# EasyEDA schematic gld_schematic_v2.json

## Sheets
1 Sheet_1
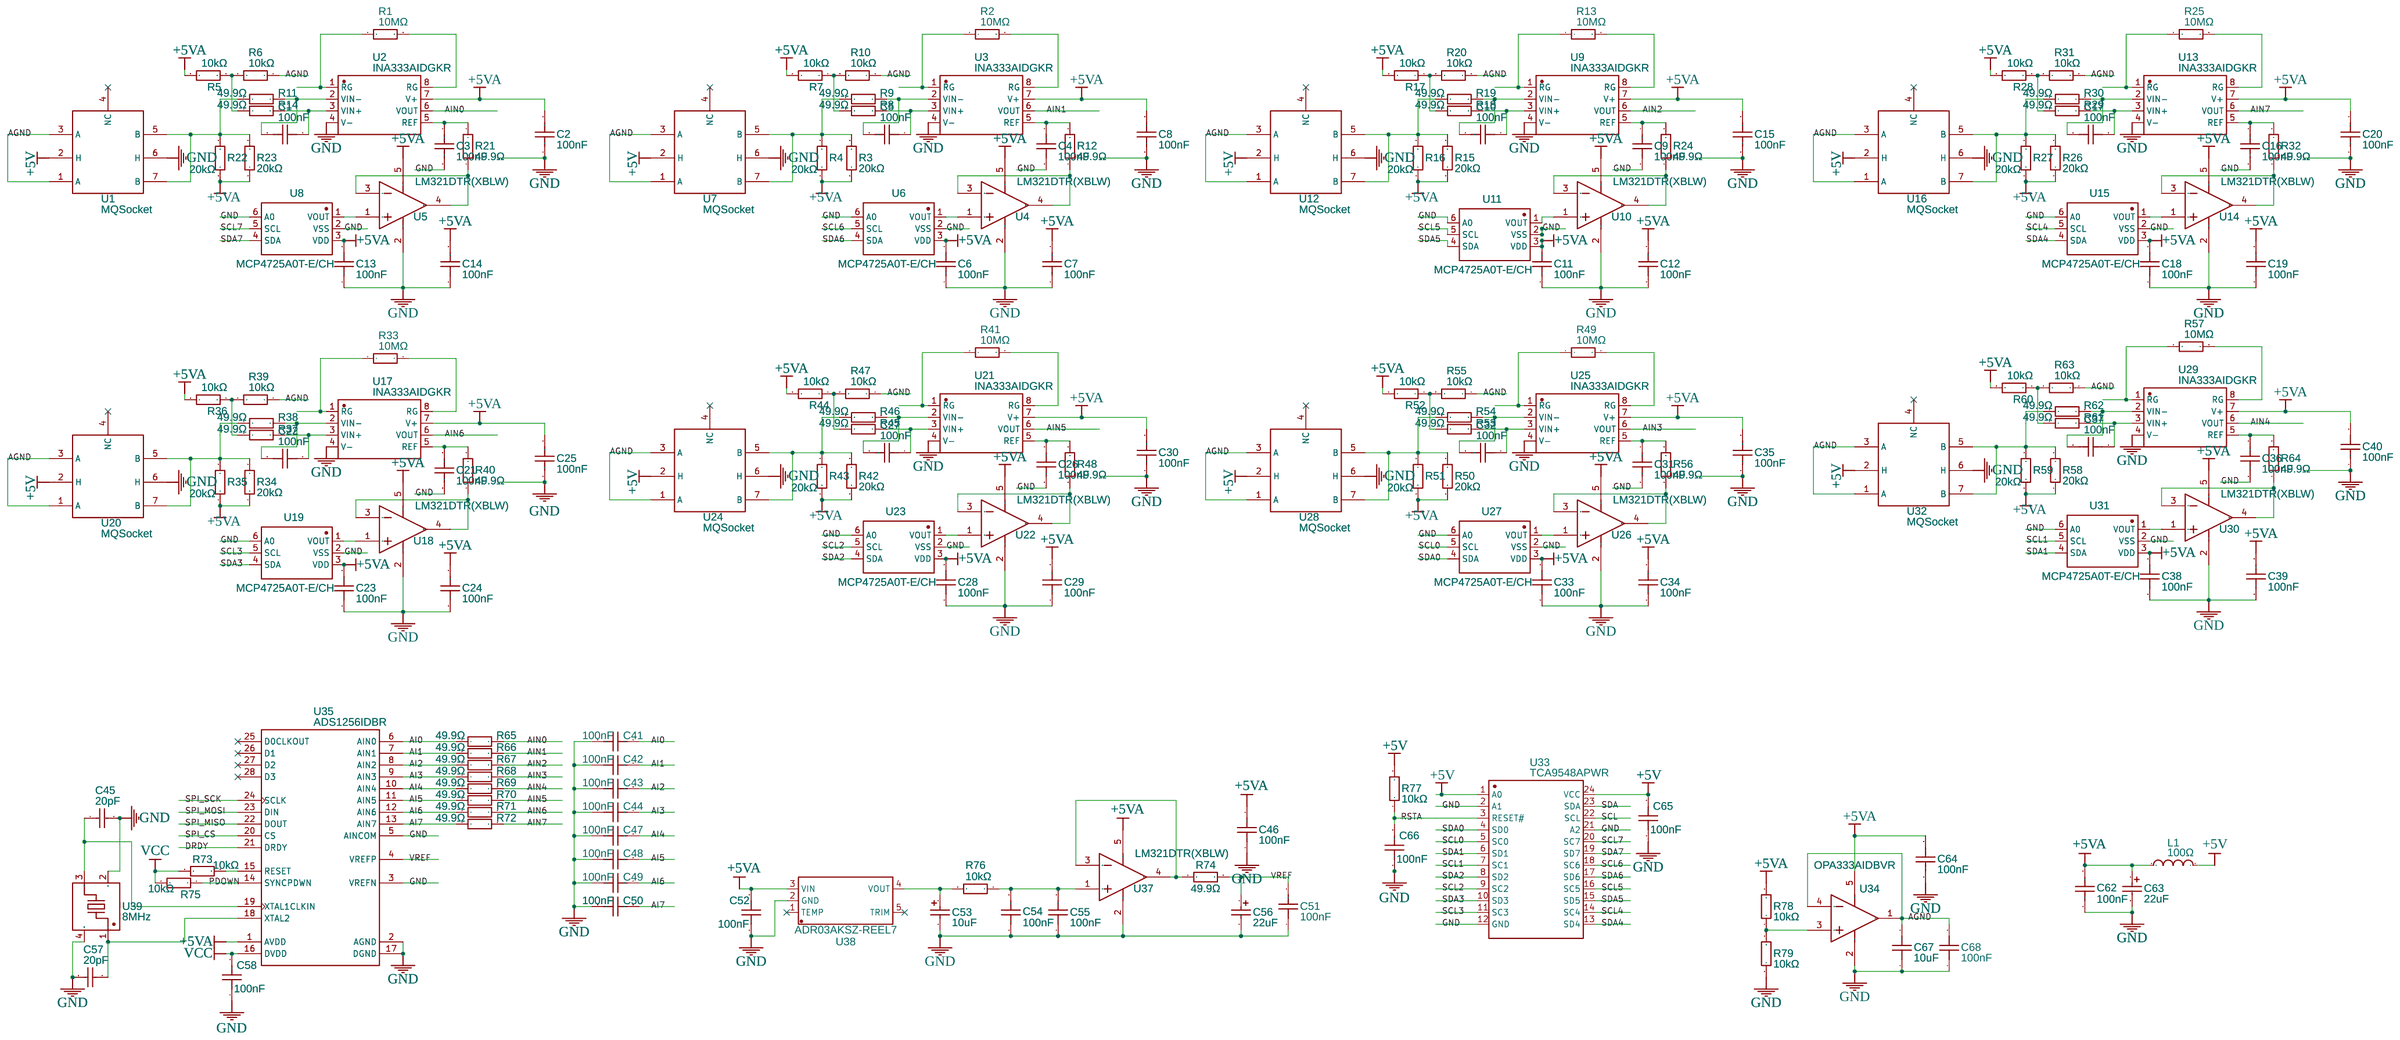
[diagram p0: Sheet_1]
2 Sheet_2: TITLE: Sheet_2; REV: 1.0; Date: 2026-03-14; Sheet: 1/1; Drawn By: mamanbudiman; Company: Your Company
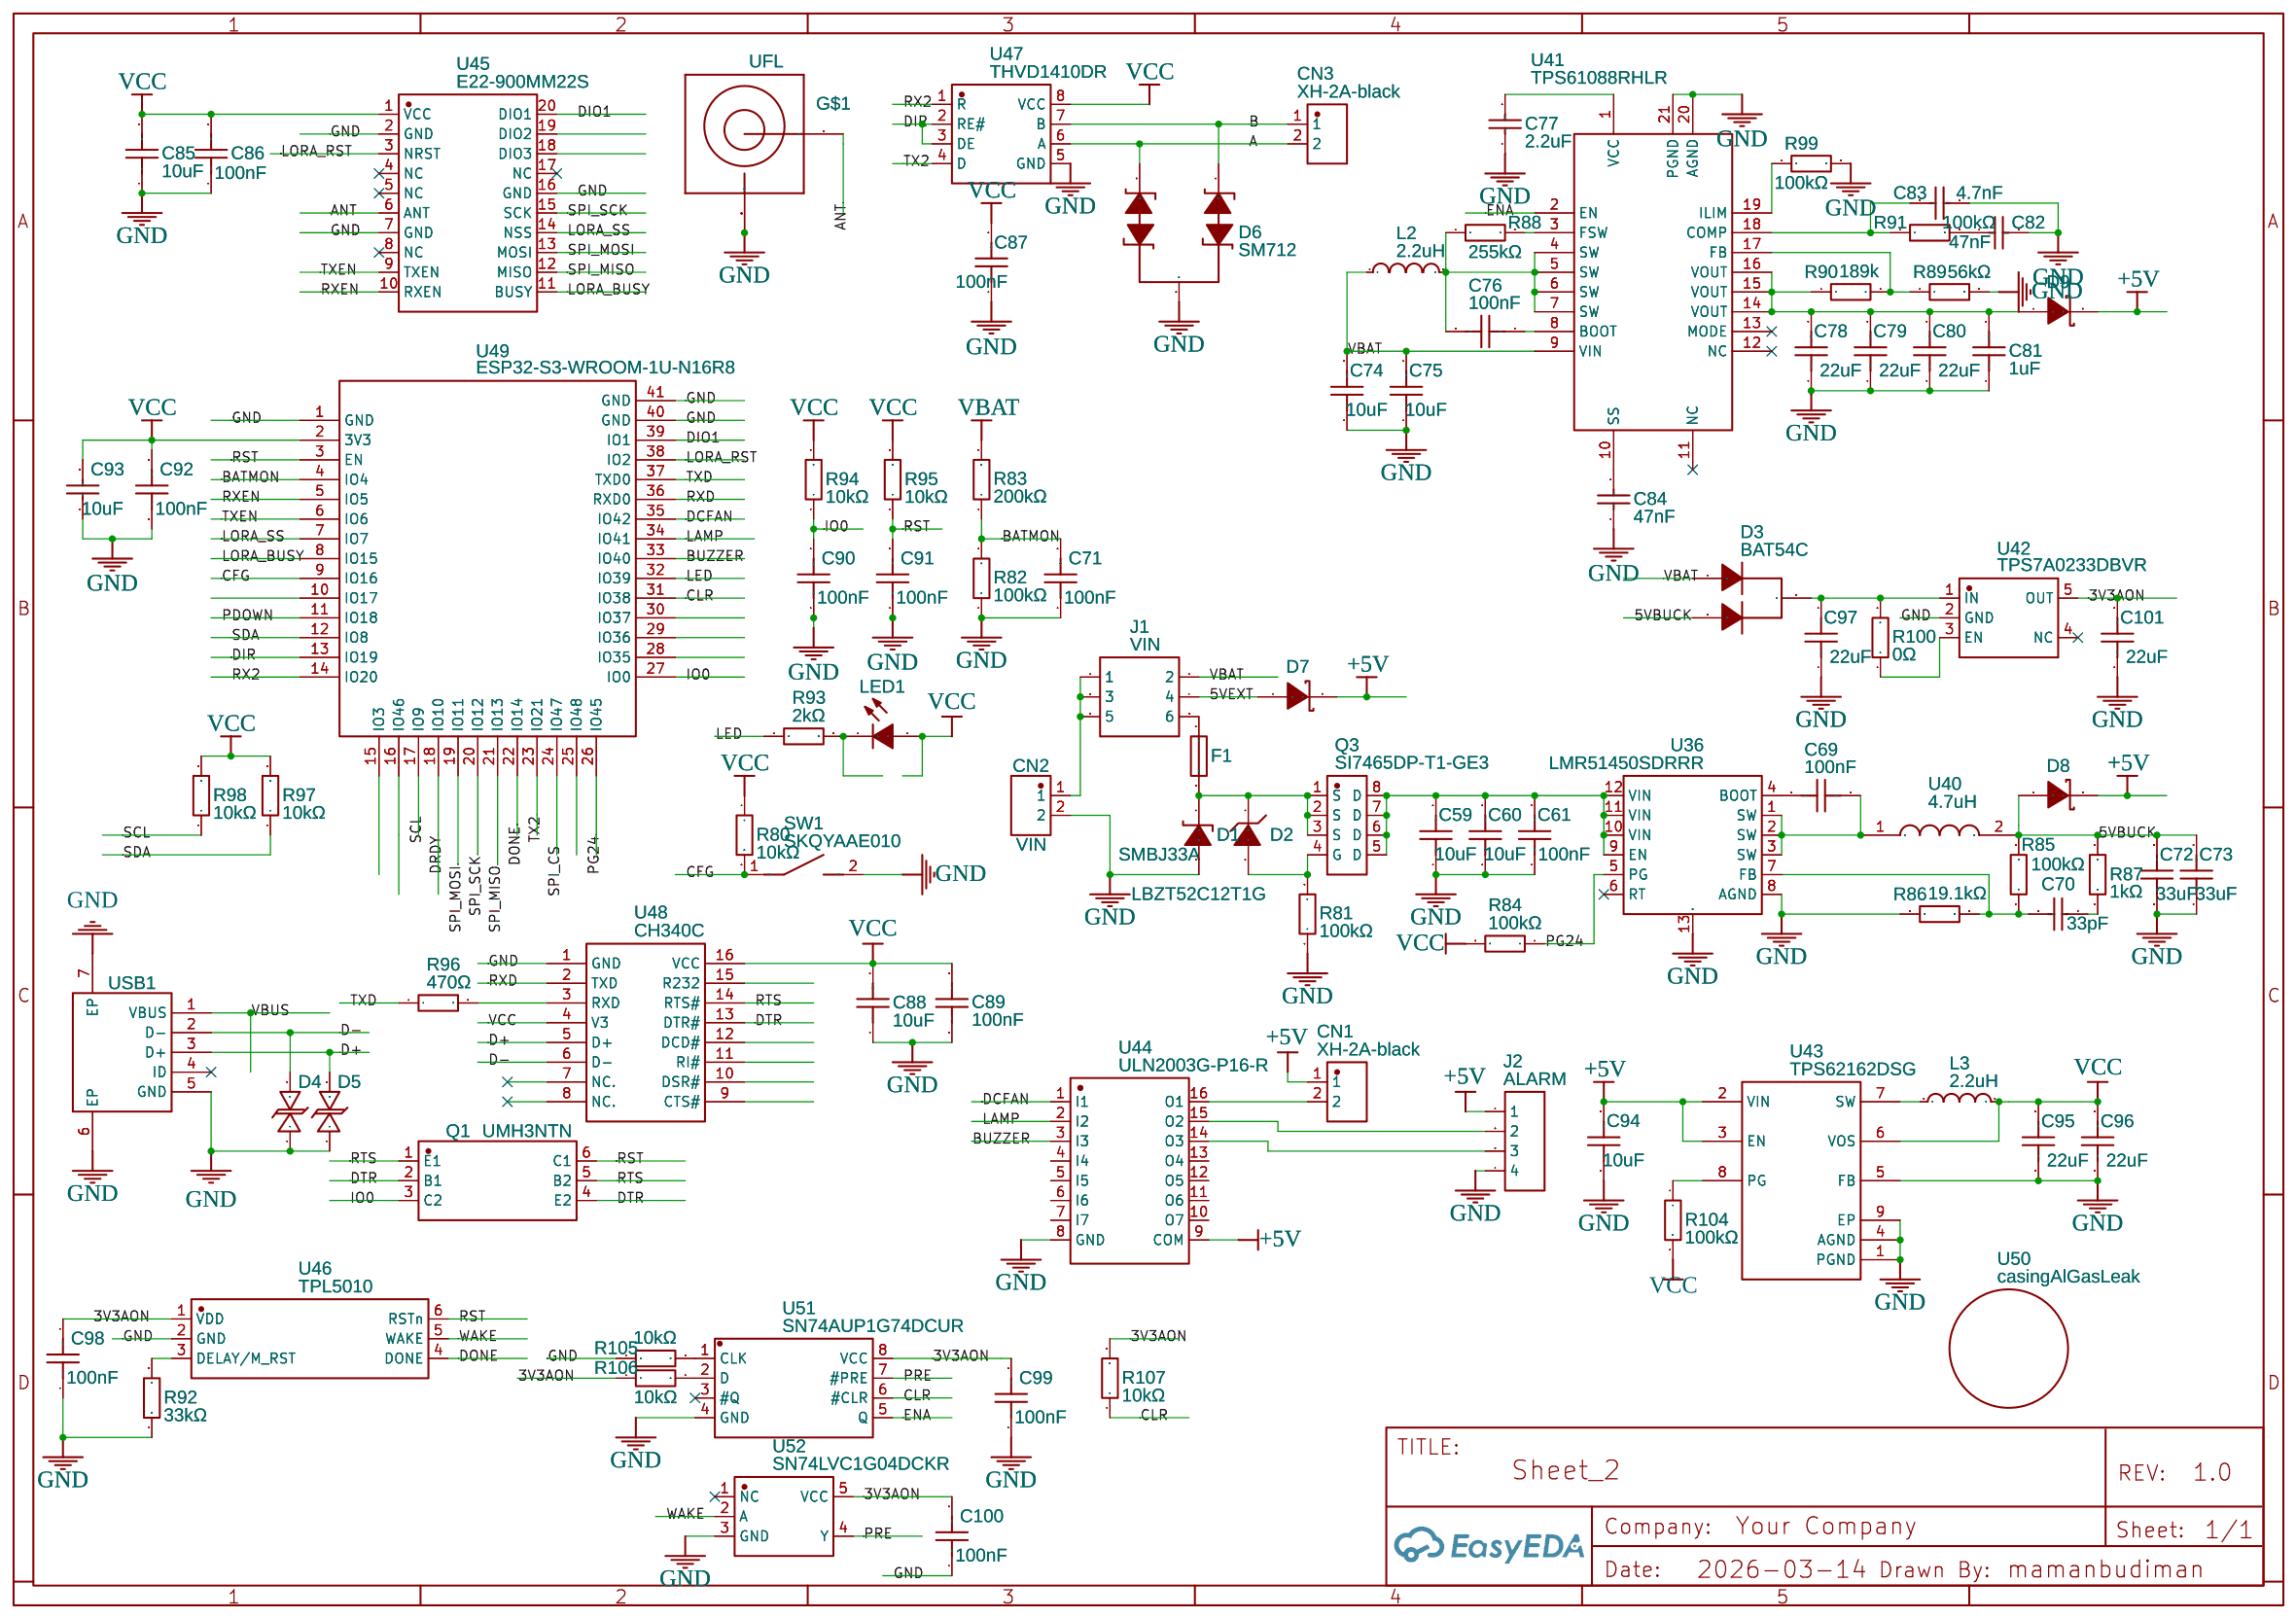
[diagram p1: Sheet_2]

## Parts
sheet Sheet_1
C1  100nF  [C0402]
C2  100nF  [C0402]
C3  100nF  [C0402]
C4  100nF  [C0402]
C5  100nF  [C0402]
C6  100nF  [C0402]
C7  100nF  [C0402]
C8  100nF  [C0402]
C9  100nF  [C0402]
C10  100nF  [C0402]
C11  100nF  [C0402]
C12  100nF  [C0402]
C13  100nF  [C0402]
C14  100nF  [C0402]
C15  100nF  [C0402]
C16  100nF  [C0402]
C17  100nF  [C0402]
C18  100nF  [C0402]
C19  100nF  [C0402]
C20  100nF  [C0402]
C21  100nF  [C0402]
C22  100nF  [C0402]
C23  100nF  [C0402]
C24  100nF  [C0402]
C25  100nF  [C0402]
C26  100nF  [C0402]
C27  100nF  [C0402]
C28  100nF  [C0402]
C29  100nF  [C0402]
C30  100nF  [C0402]
C31  100nF  [C0402]
C32  100nF  [C0402]
C33  100nF  [C0402]
C34  100nF  [C0402]
C35  100nF  [C0402]
C36  100nF  [C0402]
C37  100nF  [C0402]
C38  100nF  [C0402]
C39  100nF  [C0402]
C40  100nF  [C0402]
C41  100nF  [C0402]
C42  100nF  [C0402]
C43  100nF  [C0402]
C44  100nF  [C0402]
C45  20pF  [C0402]
C46  100nF  [C0402]
C47  100nF  [C0402]
C48  100nF  [C0402]
C49  100nF  [C0402]
C50  100nF  [C0402]
C51  100nF  [C0402]
C52  100nF  [C0402]
C53  10uF  [CAP-SMD_L3.2-W1.6-RD-C7171]
C54  100nF  [C0402]
C55  100nF  [C0402]
C56  22uF  [CASE-A_3216]
C57  20pF  [C0402]
C58  100nF  [C0603]
C62  100nF  [C0402]
C63  22uF  [CASE-A_3216]
C64  100nF  [C0603]
C65  100nF  [C0603]
C66  100nF  [C0603]
C67  10uF  [C0603]
C68  100nF  [C0603]
L1  100Ω  [L0805]
R1  10MΩ  [R0603]
R2  10MΩ  [R0603]
R3  20kΩ  [R0603]
R4  20kΩ  [R0603]
R5  10kΩ  [R0603]
R6  10kΩ  [R0603]
R7  10kΩ  [R0603]
R8  49.9Ω  [R0402]
R9  49.9Ω  [R0402]
R10  10kΩ  [R0603]
R11  49.9Ω  [R0402]
R12  49.9Ω  [R0402]
R13  10MΩ  [R0603]
R14  49.9Ω  [R0402]
R15  20kΩ  [R0603]
R16  20kΩ  [R0603]
R17  10kΩ  [R0603]
R18  49.9Ω  [R0402]
R19  49.9Ω  [R0402]
R20  10kΩ  [R0603]
R21  49.9Ω  [R0402]
R22  20kΩ  [R0603]
R23  20kΩ  [R0603]
R24  49.9Ω  [R0402]
R25  10MΩ  [R0603]
R26  20kΩ  [R0603]
R27  20kΩ  [R0603]
R28  10kΩ  [R0603]
R29  49.9Ω  [R0402]
R30  49.9Ω  [R0402]
R31  10kΩ  [R0603]
R32  49.9Ω  [R0402]
R33  10MΩ  [R0603]
R34  20kΩ  [R0603]
R35  20kΩ  [R0603]
R36  10kΩ  [R0603]
R37  49.9Ω  [R0402]
R38  49.9Ω  [R0402]
R39  10kΩ  [R0603]
R40  49.9Ω  [R0402]
R41  10MΩ  [R0603]
R42  20kΩ  [R0603]
R43  20kΩ  [R0603]
R44  10kΩ  [R0603]
R45  49.9Ω  [R0402]
R46  49.9Ω  [R0402]
R47  10kΩ  [R0603]
R48  49.9Ω  [R0402]
R49  10MΩ  [R0603]
R50  20kΩ  [R0603]
R51  20kΩ  [R0603]
R52  10kΩ  [R0603]
R53  49.9Ω  [R0402]
R54  49.9Ω  [R0402]
R55  10kΩ  [R0603]
R56  49.9Ω  [R0402]
R57  10MΩ  [R0603]
R58  20kΩ  [R0603]
R59  20kΩ  [R0603]
R60  10kΩ  [R0603]
R61  49.9Ω  [R0402]
R62  49.9Ω  [R0402]
R63  10kΩ  [R0603]
R64  49.9Ω  [R0402]
R65  49.9Ω  [R0402]
R66  49.9Ω  [R0402]
R67  49.9Ω  [R0402]
R68  49.9Ω  [R0402]
R69  49.9Ω  [R0402]
R70  49.9Ω  [R0402]
R71  49.9Ω  [R0402]
R72  49.9Ω  [R0402]
R73  10kΩ  [R0603]
R74  49.9Ω  [R0402]
R75  10kΩ  [R0603]
R76  10kΩ  [R0603]
R77  10kΩ  [R0603]
R78  10kΩ  [R0603]
R79  10kΩ  [R0603]
U1  MQSocket  [MQ_SOCKET]
U2  INA333AIDGKR  [MSOP-8_L3.0-W3.0-P0.65-LS5.0-BL]
U3  INA333AIDGKR  [MSOP-8_L3.0-W3.0-P0.65-LS5.0-BL]
U4  LM321DTR(XBLW)  [SOT-23-5_L2.9-W1.6-P0.95-LS2.8-BR]
U5  LM321DTR(XBLW)  [SOT-23-5_L2.9-W1.6-P0.95-LS2.8-BR]
U6  MCP4725A0T-E/CH  [SOT-23-6_L2.9-W1.6-P0.95-LS2.8-BL]
U7  MQSocket  [MQ_SOCKET]
U8  MCP4725A0T-E/CH  [SOT-23-6_L2.9-W1.6-P0.95-LS2.8-BL]
U9  INA333AIDGKR  [MSOP-8_L3.0-W3.0-P0.65-LS5.0-BL]
U10  LM321DTR(XBLW)  [SOT-23-5_L2.9-W1.6-P0.95-LS2.8-BR]
U11  MCP4725A0T-E/CH  [SOT-23-6_L2.9-W1.6-P0.95-LS2.8-BL]
U12  MQSocket  [MQ_SOCKET]
U13  INA333AIDGKR  [MSOP-8_L3.0-W3.0-P0.65-LS5.0-BL]
U14  LM321DTR(XBLW)  [SOT-23-5_L2.9-W1.6-P0.95-LS2.8-BR]
U15  MCP4725A0T-E/CH  [SOT-23-6_L2.9-W1.6-P0.95-LS2.8-BL]
U16  MQSocket  [MQ_SOCKET]
U17  INA333AIDGKR  [MSOP-8_L3.0-W3.0-P0.65-LS5.0-BL]
U18  LM321DTR(XBLW)  [SOT-23-5_L2.9-W1.6-P0.95-LS2.8-BR]
U19  MCP4725A0T-E/CH  [SOT-23-6_L2.9-W1.6-P0.95-LS2.8-BL]
U20  MQSocket  [MQ_SOCKET]
U21  INA333AIDGKR  [MSOP-8_L3.0-W3.0-P0.65-LS5.0-BL]
U22  LM321DTR(XBLW)  [SOT-23-5_L2.9-W1.6-P0.95-LS2.8-BR]
U23  MCP4725A0T-E/CH  [SOT-23-6_L2.9-W1.6-P0.95-LS2.8-BL]
U24  MQSocket  [MQ_SOCKET]
U25  INA333AIDGKR  [MSOP-8_L3.0-W3.0-P0.65-LS5.0-BL]
U26  LM321DTR(XBLW)  [SOT-23-5_L2.9-W1.6-P0.95-LS2.8-BR]
U27  MCP4725A0T-E/CH  [SOT-23-6_L2.9-W1.6-P0.95-LS2.8-BL]
U28  MQSocket  [MQ_SOCKET]
U29  INA333AIDGKR  [MSOP-8_L3.0-W3.0-P0.65-LS5.0-BL]
U30  LM321DTR(XBLW)  [SOT-23-5_L2.9-W1.6-P0.95-LS2.8-BR]
U31  MCP4725A0T-E/CH  [SOT-23-6_L2.9-W1.6-P0.95-LS2.8-BL]
U32  MQSocket  [MQ_SOCKET]
U33  TCA9548APWR  [TSSOP-24_L7.8-W4.4-P0.65-LS6.4-BL]
U34  OPA333AIDBVR  [SOT-23-5_L3.0-W1.7-P0.95-LS2.8-BR]
U35  ADS1256IDBR  [SSOP-28_L10.2-W5.3-P0.65-LS7.8-BL]
U37  LM321DTR(XBLW)  [SOT-23-5_L2.9-W1.6-P0.95-LS2.8-BR]
U38  ADR03AKSZ-REEL7  [SC-70-5_L2.0-W1.3-P0.65-LS2.1-BL]
U39  8MHz  [CRYSTAL-SMD_4P-L3.2-W2.5-BL-1]
sheet Sheet_2
C59  10uF  [C0805]
C60  10uF  [C0805]
C61  100nF  [C0603]
C69  100nF  [C0603]
C70  33pF  [C0603]
C71  100nF  [C0603]
C72  33uF  [C0805]
C73  33uF  [C0805]
C74  10uF  [C0805]
C75  10uF  [C0805]
C76  100nF  [C0603]
C77  2.2uF  [C0603]
C78  22uF  [C0603]
C79  22uF  [C0603]
C80  22uF  [C0603]
C81  1uF  [C0603]
C82  47nF  [C0603]
C83  4.7nF  [C0603]
C84  47nF  [C0603]
C85  10uF  [C0603]
C86  100nF  [C0603]
C87  100nF  [C0402]
C88  10uF  [C0603]
C89  100nF  [C0603]
C90  100nF  [C0603]
C91  100nF  [C0603]
C92  100nF  [C0603]
C93  10uF  [C1206]
C94  10uF  [C0805]
C95  22uF  [C0603]
C96  22uF  [C0603]
C97  22uF  [C0603]
C98  100nF  [C0603]
C99  100nF  [C0603]
C100  100nF  [C0603]
C101  22uF  [C0603]
CN1  XH-2A-black  [CONN-TH_2P-P2.50_XH-2A-BLACK]
CN2  VIN  [CONN-TH_2P-P2.50_XH-2A-BLACK]
CN3  XH-2A-black  [CONN-TH_2P-P2.50_XH-2A-BLACK]
D1  SMBJ33A  [SMB_L4.6-W3.6-LS5.3-RD]
D2  LBZT52C12T1G  [SOD-123_L2.8-W1.8-LS3.7-RD]
D3  BAT54C  [SOT-23-3_L2.9-W1.6-P1.90-LS2.8-BR]
D4  LESD5D5.0CT1G_C5199850  [SOD-523_L1.2-W0.8-LS1.6-BI]
D5  LESD5D5.0CT1G_C5199850  [SOD-523_L1.2-W0.8-LS1.6-BI]
D6  SM712  [SOT-23_L2.9-W1.3-P1.90-LS2.4-BR]
D7  SS54_C22452  [SMA_L4.4-W2.8-LS5.4-R-RD]
D8  SS54_C22452  [SMA_L4.4-W2.8-LS5.4-R-RD]
D9  SS54_C22452  [SMA_L4.4-W2.8-LS5.4-R-RD]
F1  MINISMDC260F/16  [F1812]
G$1  UFL  [U.FL-R-SMT-1(60)]
J1  VIN  [HDR-M-2.54_2X3]
J2  ALARM  [HDR-M-2.54_1X4]
L2  2.2uH  [IND-SMD_L10.4-W10.3]
L3  2.2uH  [IND-SMD_L3.0-W3.0_SMNR3015]
LED1  19-217/BHC-ZL1M2RY/3T  [LED0603-R-RD]
Q1  UMH3NTN  [SOT-363_L2.0-W1.3-P0.65-LS2.1-TL]
Q3  SI7465DP-T1-GE3  [POWERPAK-SO-8_L5.9-W4.9-P1.27-LS6.2-BL]
R80  10kΩ  [R0603]
R81  100kΩ  [R0603]
R82  100kΩ  [R0603]
R83  200kΩ  [R0603]
R84  100kΩ  [R0603]
R85  100kΩ  [R0603]
R86  19.1kΩ  [R0603]
R87  1kΩ  [R0603]
R88  255kΩ  [R0603]
R89  56kΩ  [R0603]
R90  189k  [R0603]
R91  100kΩ  [R0603]
R92  33kΩ  [R0603]
R93  2kΩ  [R0603]
R94  10kΩ  [R0603]
R95  10kΩ  [R0603]
R96  470Ω  [R0603]
R97  10kΩ  [R0603]
R98  10kΩ  [R0603]
R99  100kΩ  [R0603]
R100  0Ω  [R0603]
R104  100kΩ  [R0603]
R105  10kΩ  [R0603]
R106  10kΩ  [R0603]
R107  10kΩ  [R0603]
SW1  SKQYAAE010  [KEY-SMD_L6.1-W3.7-LS6.8]
U36  LMR51450SDRRR  [WSON-12_L3.0-W3.0-P0.50-TL-EP-2]
U40  4.7uH  [IND-SMD_L7.3-W6.6]
U41  TPS61088RHLR  [VQFN-20_L4.6-W3.6-P0.50-BL]
U42  TPS7A0233DBVR  [SOT-23-5_L2.9-W1.6-P0.95-LS2.8-BL]
U43  TPS62162DSG  [WSON-8_L2.0-W2.0-P0.50-TL-EP]
U44  ULN2003G-P16-R  [TSSOP-16_L5.0-W4.4-P0.65-LS6.4-BL]
U45  E22-900MM22S  [WIRELM-SMD_20P-L10.0-W10.0-P1.27-TL]
U46  TPL5010  [SOT-23-6_L2.9-W1.6-P0.95-LS2.8-BR]
U47  THVD1410DR  [SOIC-8_L4.9-W3.9-P1.27-LS6.0-BL]
U48  CH340C  [SOP-16_L10.0-W3.9-P1.27-LS6.0-BL]
U49  ESP32-S3-WROOM-1U-N16R8  [WIRELM-SMD_ESP32-S3-WROOM-1U]
U50  casingAlGasLeak  [CASINGALGASLEAK]
U51  SN74AUP1G74DCUR  [VSSOP-8_L2.1-W2.4-P0.50-LS3.2-BR]
U52  SN74LVC1G04DCKR  [SOT-353_L2.1-W1.3-P0.65-LS2.3-BR]
USB1  U-D-M5DD-W-1  [MICRO-USB-TH_MICRO-USB-A14]

## Library data of the parts
C1-C44 C46-C52 C54 C55 C62 C87 = CL05B104KO5NNNC: Supplier: LCSC; Manufacturer: SAMSUNG(三星); Supplier Part: C1525; JLCPCB Part Class: Basic Part
C45 C57 = 0402CG200J500NT: Supplier: LCSC; Manufacturer: FH(风华); Supplier Part: C1554; JLCPCB Part Class: Basic Part
C53 = TAJA106K016RNJ: Supplier: LCSC; Manufacturer: Kyocera AVX; Supplier Part: C7171; JLCPCB Part Class: Basic Part
C56 C63 = TAJA226M010RNJ: Supplier: LCSC; Manufacturer: Kyocera AVX; Supplier Part: C7183; JLCPCB Part Class: Extended Part
C58 C61 C65 C66 C69 C71 C76 C90-C92 C98-C100 = CC0603KRX7R9BB104: Supplier: LCSC; Manufacturer: YAGEO; Supplier Part: C14663; JLCPCB Part Class: Basic Part
C64 C68 C86 = CC0603KRX7R9BB104: Supplier: LCSC; Manufacturer: YAGEO(国巨); Supplier Part: C14663; JLCPCB Part Class: Basic Part
C67 = CL10A106KP8NNNC: Supplier: LCSC; Manufacturer: SAMSUNG(三星); Supplier Part: C19702; JLCPCB Part Class: Basic Part
L1 = GZ2012D101TF: Supplier: LCSC; Manufacturer: Sunlord(顺络); Supplier Part: C1015; JLCPCB Part Class: Basic Part
R1 R2 R13 R25 R33 R41 R49 R57 = 0603WAF1005T5E: Supplier: LCSC; Manufacturer: UNI-ROYAL(厚声); Supplier Part: C7250; JLCPCB Part Class: Basic Part
R3 R4 R15 R16 R22 R23 R26 R27 R34 R35 R42 R43 R50 R51 R58 R59 = 0603WAF2002T5E: Supplier: LCSC; Manufacturer: UNI-ROYAL(厚声); Supplier Part: C4184; JLCPCB Part Class: Basic Part
R5-R7 R10 R17 R20 R28 R31 R36 R39 R44 R47 R52 R55 R60 R63 R73 R75 R76 R78 R79 = RT0603BRD0710KL: Supplier: LCSC; Manufacturer: YAGEO(国巨); Supplier Part: C95204; JLCPCB Part Class: Extended Part
R8 R9 R11 R12 R14 R18 R19 R21 R24 R29 R30 R32 R37 R38 R40 R45 R46 R48 R53 R54 R56 R61 R62 R64-R72 R74 = RC-02K49R9FT: Contributor: LCSC; Supplier: LCSC; Supplier Part: C140147; Manufacturer: FH(风华); JLCPCB Part Class: Extended Part
R77 R80 R94 R95 R97 R98 R105-R107 = 0603WAF1002T5E: Supplier: LCSC; Manufacturer: UniOhm; Supplier Part: C25804; Resistance (Ohms): 10K; JLCPCB Part Class: Basic Part
U1 U7 U12 U16 U20 U24 U28 U32 = MQSocket: Contributor: mamanbudiman
U2 U3 U9 U13 U17 U21 U25 U29 = INA333AIDGKR: Supplier: LCSC; Manufacturer: TI(德州仪器); Supplier Part: C19450; JLCPCB Part Class: Extended Part
U4 U5 U10 U14 U18 U22 U26 U30 U37 = LM321DTR(XBLW): Supplier: LCSC; Supplier Part: C18723612; Manufacturer: XBLW(芯伯乐); Contributor: lcsc; JLCPCB Part Class: Extended Part
U6 U8 U11 U15 U19 U23 U27 U31 = MCP4725A0T-E/CH: Contributor: LCSC; Supplier: LCSC; Manufacturer: MICROCHIP(美国微芯); Supplier Part: C144198; JLCPCB Part Class: Extended Part
U33 = TCA9548APWR: Supplier: LCSC; Manufacturer: TI(德州仪器); Supplier Part: C130026; JLCPCB Part Class: Extended Part
U34 = OPA333AIDBVR: Contributor: LCSC; Supplier: LCSC; Manufacturer: TI(德州仪器); Supplier Part: C30878; JLCPCB Part Class: Extended Part
U35 = ADS1256IDBR: Supplier: LCSC; Manufacturer: TI(德州仪器); Supplier Part: C28186; JLCPCB Part Class: Extended Part
U38 = ADR03AKSZ-REEL7: Contributor: LCSC; Supplier: LCSC; Supplier Part: C206683; Manufacturer: ADI(亚德诺); JLCPCB Part Class: Extended Part
U39 = 3TJ480000NYLBC: Supplier: LCSC; Supplier Part: C2924618; Manufacturer: JYJE(晶友嘉); Contributor: lcsc; JLCPCB Part Class: Extended Part
C59 C60 C74 C75 C94 = GRM21BR61H106KE43L: Contributor: LCSC; Supplier: LCSC; Supplier Part: C440198; Manufacturer: muRata(村田); JLCPCB Part Class: Basic Part
C70 = CL10C330JB8NNNC: Supplier: LCSC; Manufacturer: SAMSUNG(三星); Supplier Part: C1663; JLCPCB Part Class: Basic Part
C72 C73 = C2012X5R1A336MTJ00E: Contributor: LCSC; Supplier: LCSC; Supplier Part: C342635; Manufacturer: TDK; JLCPCB Part Class: Extended Part
C77 = CL10A225KO8NNNC: Supplier: LCSC; Manufacturer: SAMSUNG(三星); Supplier Part: C23630; JLCPCB Part Class: Basic Part
C78-C80 C95-C97 C101 = CL10A226MQ8NRNC: Supplier: LCSC; Manufacturer: SAMSUNG(三星); Supplier Part: C59461; JLCPCB Part Class: Basic Part
C81 = CL10A105KB8NNNC: Supplier: LCSC; Manufacturer: SAMSUNG(三星); Supplier Part: C15849; JLCPCB Part Class: Basic Part
C82 C84 = CL10B473KB8NNNC: Supplier: LCSC; Manufacturer: SAMSUNG(三星); Supplier Part: C1622; JLCPCB Part Class: Basic Part
C83 = 0603B472K500NT: Supplier: LCSC; Manufacturer: FH(风华); Supplier Part: C53987; JLCPCB Part Class: Basic Part
C85 = CL10A106KP8NNNC: Supplier: LCSC; Manufacturer: SAMSUNG; Supplier Part: C19702; JLCPCB Part Class: Basic Part
C88 = CL10A106KP8NNNC: Supplier: LCSC; Manufacturer: SAMSUNG(三星); Supplier Part: C19702; JLCPCB Part Class: Basic Part; link: https://lcsc.com/eda_search?q=C19702&%26type=1&ref=editor
C89 = CC0603KRX7R9BB104: Supplier: LCSC; Manufacturer: YAGEO(国巨); Supplier Part: C14663; JLCPCB Part Class: Basic Part; link: https://lcsc.com/eda_search?q=C14663&%26type=1&ref=editor
C93 = CL31A106KBHNNNE: Supplier: LCSC; Manufacturer: SAMSUNG; Supplier Part: C13585; JLCPCB Part Class: Basic Part
CN1-CN3 = XH-2A-black: Supplier: LCSC; Manufacturer: BOOMELE(博穆精密); Manufacturer Part: XH-2A黑色; Supplier Part: C24193; JLCPCB Part Class: Extended Part
D1 = SMBJ33A: Supplier: LCSC; Manufacturer: RUILON(瑞隆源); Supplier Part: C10219; JLCPCB Part Class: Extended Part
D2 = LBZT52C12T1G: Supplier: LCSC; Manufacturer: LRC(乐山无线电); Supplier Part: C12747; JLCPCB Part Class: Extended Part
D3 = BAT54C: Supplier: LCSC; Manufacturer: CJ(江苏长电/长晶); Supplier Part: C2135; JLCPCB Part Class: Extended Part
D4 D5 = LESD5D5.0CT1G_C5199850: Supplier: LCSC; Supplier Part: C5199850; Manufacturer: UMW(友台半导体); Manufacturer Part: LESD5D5.0CT1G; JLCPCB Part Class: Extended Part; Contributor: lcsc; Convert to PCB: Yes; Add into BOM: Yes
D6 = SM712_C293966: Contributor: LCSC; Supplier: LCSC; Supplier Part: C293966; Manufacturer: DOWO(东沃); JLCPCB Part Class: Extended Part
D7-D9 = SS54_C22452: Supplier: LCSC; Manufacturer Part: SS54; Manufacturer: MDD(辰达半导体); Supplier Part: C22452; JLCPCB Part Class: Basic Part
F1 = MINISMDC260F/16: Contributor: LCSC; Supplier: LCSC; Supplier Part: C16490; Manufacturer: Littelfuse(美国力特); Manufacturer Part: MINISMDC260F/16-2; JLCPCB Part Class: Extended Part
G$1 = UFL: Contributor: BrianHenning
J1 = HDR-M-2.54_2x3: Supplier Part: C65114; Supplier: LCSC; Contributor: LCEDA_Lib
J2 = HDR-M-2.54_1x4: Supplier Part: C124378; Supplier: LCSC; Contributor: LCEDA_Lib
L2 = SMDRH105R-2R2NT: Supplier: LCSC; Manufacturer: SXN(顺翔诺); Supplier Part: C10164; JLCPCB Part Class: Extended Part
L3 = ANR3015T2R2M: Supplier: LCSC; Supplier Part: C6364793; Manufacturer: APV(爱普微); JLCPCB Part Class: Extended Part; Contributor: lcsc
LED1 = 19-217/BHC-ZL1M2RY/3T: Supplier: LCSC; Manufacturer: EVERLIGHT; LCSC Assembly: Yes; image: //image.lceda.cn/szlcsc/C72041.jpg; Supplier Part: C72041; SMT Type: Basic
Q1 = UMH3NTN: Contributor: LCSC; Supplier: LCSC; Manufacturer: ROHM(罗姆); Supplier Part: C123008; JLCPCB Part Class: Extended Part; link: https://lcsc.com/eda_search?q=C123008&%26type=1&ref=editor
Q3 = SI7465DP-T1-GE3: Contributor: LCSC; Supplier: LCSC; Supplier Part: C499482; Manufacturer: VISHAY(威世); JLCPCB Part Class: Extended Part
R81 R82 R84 R85 R91 R99 R104 = 0603WAF1003T5E: Supplier: LCSC; Manufacturer: UNI-ROYAL(厚声); Supplier Part: C25803; JLCPCB Part Class: Basic Part
R83 = 0603WAF2003T5E: Supplier: LCSC; Manufacturer: UNI-ROYAL(厚声); Supplier Part: C25811; JLCPCB Part Class: Basic Part
R86 = 0603WAF1912T5E: Supplier: LCSC; Manufacturer: UNI-ROYAL(厚声); Supplier Part: C22897; JLCPCB Part Class: Extended Part
R87 = 0603WAF1001T5E: Supplier: LCSC; Manufacturer: UNI-ROYAL(厚声); Supplier Part: C21190; JLCPCB Part Class: Basic Part
R88 = 0603WAF2553T5E: Supplier: LCSC; Manufacturer: UNI-ROYAL(厚声); Supplier Part: C23354; JLCPCB Part Class: Extended Part
R89 = 0603WAF5602T5E: Supplier: LCSC; Manufacturer: UNI-ROYAL(厚声); Supplier Part: C23206; JLCPCB Part Class: Basic Part
R90 = RT0603BRD07189KL: Contributor: LCSC; Supplier: LCSC; Supplier Part: C861174; Manufacturer: YAGEO(国巨); JLCPCB Part Class: Extended Part
R92 = 0603WAF3302T5E: Supplier: LCSC; Manufacturer: UNI-ROYAL(厚声); Supplier Part: C4216; JLCPCB Part Class: Basic Part
R93 = 0603WAF2001T5E: Supplier: LCSC; Manufacturer: UNI-ROYAL(厚声); Supplier Part: C22975; JLCPCB Part Class: Basic Part
R96 = 0603WAF4700T5E: Supplier: LCSC; Manufacturer: UNI-ROYAL(厚声); Supplier Part: C23179; JLCPCB Part Class: Basic Part; link: https://lcsc.com/eda_search?q=C23179&%26type=1&ref=editor
R100 = 0603WAF0000T5E: Supplier: LCSC; Manufacturer: UNI-ROYAL(厚声); Supplier Part: C21189; JLCPCB Part Class: Basic Part
SW1 = SKQYAAE010: Supplier: LCSC; Manufacturer: ALPSALPINE(阿尔卑斯阿尔派); Supplier Part: C115352; JLCPCB Part Class: Extended Part
U36 = LMR51450SDRRR: Supplier: LCSC; Supplier Part: C6890985; Manufacturer: TI(德州仪器); JLCPCB Part Class: Extended Part; Contributor: lcsc
U40 = GSSM06304R7M2AU: Contributor: lcsc; Supplier: LCSC; Supplier Part: C2928306; Manufacturer: ABC(千如); JLCPCB Part Class: Extended Part
U41 = TPS61088RHLR: Supplier: LCSC; Manufacturer: TI(德州仪器); Supplier Part: C87357; JLCPCB Part Class: Extended Part
U42 = TPS7A0233DBVR: Supplier: LCSC; Supplier Part: C5142805; Manufacturer: TI(德州仪器); JLCPCB Part Class: Extended Part; Contributor: lcsc
U43 = TPS62162DSG: Supplier: LCSC; Manufacturer: TI(德州仪器); Manufacturer Part: TPS62162DSGR; Supplier Part: C40256; JLCPCB Part Class: Extended Part
U44 = ULN2003G-P16-R: Supplier: LCSC; Manufacturer: UTC(友顺); Supplier Part: C91443; JLCPCB Part Class: Extended Part
U45 = E22-900MM22S: Supplier: LCSC; Supplier Part: C5333985; Manufacturer: EBYTE(亿佰特); JLCPCB Part Class: Extended Part; Contributor: lcsc
U46 = TPL5010DDCR: Contributor: LCSC; Supplier: LCSC; Supplier Part: C473912; Manufacturer: TI(德州仪器); JLCPCB Part Class: Extended Part
U47 = THVD1410DR: Contributor: LCSC; Supplier: LCSC; Supplier Part: C2671345; Manufacturer: TI(德州仪器); JLCPCB Part Class: Extended Part
U48 = CH340C: Supplier: LCSC; Manufacturer: WCH(南京沁恒); Supplier Part: C84681; JLCPCB Part Class: Extended Part; link: https://lcsc.com/eda_search?q=C84681&%26type=1&ref=editor
U49 = ESP32-S3-WROOM-1U-N16R8: Contributor: lcsc; Supplier: LCSC; Supplier Part: C3013946; Manufacturer: ESPRESSIF(乐鑫); JLCPCB Part Class: Extended Part
U50 = casingAlGasLeak: Contributor: mamanbudiman
U51 = SN74AUP1G74DCUR: Contributor: LCSC; Supplier: LCSC; Supplier Part: C140267; Manufacturer: TI(德州仪器); JLCPCB Part Class: Extended Part
U52 = SN74LVC1G04DCKR: Supplier: LCSC; Manufacturer: TI(德州仪器); Supplier Part: C8207; JLCPCB Part Class: Extended Part
USB1 = U-D-M5DD-W-1: Contributor: LCSC; Supplier: LCSC; Manufacturer: 韩国韩荣; Supplier Part: C145795; JLCPCB Part Class: Extended Part

## Nets
3V3AON: C98.2 C99.2 C100.2 C101.2 R106.1 R107.2 U42.5(OUT) U46.1(VDD) U51.8(VCC) U52.5(VCC)
5VBUCK: C72.2 C73.2 D3.2(A2) D8.1(A) R85.2 R87.2 U40.2
5VEXT: D7.1(A) J1.4
+5V: C65.2 C94.2 CN1.1 D7.2(K) D8.2(K) D9.2(K) J2.1 L1.2 R77.2 U1.2(H) U7.2(H) U12.2(H) U16.2(H) U20.2(H) U24.2(H) U28.2(H) U32.2(H) U33.1(A0) U33.24(VCC) U43.2(VIN) U43.3(EN) U44.9(COM)
+5VA: C2.2 C6.2 C7.2 C8.2 C11.2 C12.2 C13.2 C14.2 C15.2 C18.2 C19.2 C20.2 C23.2 C24.2 C25.2 C28.2 C29.2 C30.2 C33.2 C34.2 C35.2 C38.2 C39.2 C40.2 C46.2 C52.2 C62.2 C63.1 C64.2 L1.1 R3.1 R4.1 R5.2 R7.2 R15.1 R16.1 R17.2 R22.1 R23.1 R26.1 R27.1 R28.2 R34.1 R35.1 R36.2 R42.1 R43.1 R44.2 R50.1 R51.1 R52.2 R58.1 R59.1 R60.2 R78.2 U2.7(V+) U3.7(V+) U4.5(V+) U5.5(V+) U6.3(VDD) U8.3(VDD) U9.7(V+) U10.5(V+) U11.3(VDD) U13.7(V+) U14.5(V+) U15.3(VDD) U17.7(V+) U18.5(V+) U19.3(VDD) U21.7(V+) U22.5(V+) U23.3(VDD) U25.7(V+) U26.5(V+) U27.3(VDD) U29.7(V+) U30.5(V+) U31.3(VDD) U34.5(V+) U35.1(AVDD) U37.5(V+) U38.3(VIN)
AGND: C67.2 C68.2 R6.1 R10.1 R20.1 R31.1 R39.1 R47.1 R55.1 R63.1 U1.1(A) U1.3(A) U7.1(A) U7.3(A) U12.1(A) U12.3(A) U16.1(A) U16.3(A) U20.1(A) U20.3(A) U24.1(A) U24.3(A) U28.1(A) U28.3(A) U32.1(A) U32.3(A) U34.1(OUT) U34.4(IN-)
GND: C2.1 C3.2 C4.2 C6.1 C7.1 C8.1 C9.2 C11.1 C12.1 C13.1 C14.1 C15.1 C16.2 C18.1 C19.1 C20.1 C21.2 C23.1 C24.1 C25.1 C26.2 C28.1 C29.1 C30.1 C31.2 C33.1 C34.1 C35.1 C36.2 C38.1 C39.1 C40.1 C41.1 C42.1 C43.1 C44.1 C45.2 C46.1 C47.1 C48.1 C49.1 C50.1 C51.1 C52.1 C53.2 C54.1 C55.1 C56.2 C57.1 C58.1 C59.1 C60.1 C61.1 C62.1 C63.2 C64.1 C65.1 C66.1 C67.1 C68.1 C71.1 C72.1 C73.1 C74.1 C75.1 C77.1 C78.1 C79.1 C80.1 C81.1 C82.2 C83.2 C84.1 C85.1 C86.1 C87.1 C88.1 C89.1 C90.1 C91.1 C92.1 C93.1 C94.1 C95.1 C96.1 C97.1 C98.1 C99.1 C100.1 C101.1 CN2.2 D1.2(A) D4.1 D5.1 D6.3 G$1.GND1(GND) G$1.GND2(GND) J2.4 R79.1 R81.1 R82.1 R86.1 R89.2 R92.1 R99.2 R105.1 SW1.2 U1.6(H) U2.4(V-) U3.4(V-) U4.2(V-) U5.2(V-) U6.2(VSS) U6.6(A0) U7.6(H) U8.2(VSS) U8.6(A0) U9.4(V-) U10.2(V-) U11.2(VSS) U11.6(A0) U12.6(H) U13.4(V-) U14.2(V-) U15.2(VSS) U15.6(A0) U16.6(H) U17.4(V-) U18.2(V-) U19.2(VSS) U19.6(A0) U20.6(H) U21.4(V-) U22.2(V-) U23.2(VSS) U23.6(A0) U24.6(H) U25.4(V-) U26.2(V-) U27.2(VSS) U27.6(A0) U28.6(H) U29.4(V-) U30.2(V-) U31.2(VSS) U31.6(A0) U32.6(H) U33.2(A1) U33.12(GND) U33.21(A2) U34.2(V-) U35.2(AGND) U35.3(VREFN) U35.5(AINCOM) U35.17(DGND) U36.8(AGND) U36.13(EP) U37.2(V-) U38.2(GND) U39.2(GND) U39.4(GND) U41.20(AGND) U41.21(PGND) U42.2(GND) U43.1(PGND) U43.4(AGND) U43.5(FB) U43.9(EP) U44.8(GND) U45.2(GND) U45.7(GND) U45.16(GND) U46.2(GND) U47.5(GND) U48.1(GND) U49.1(GND) U49.40(GND) U49.41(GND) U51.4(GND) U52.3(GND) USB1.5(GND) USB1.6(EP) USB1.7(EP)
VBAT: C74.2 C75.2 D3.1(A1) J1.2 L2.1 R83.2 U41.9(VIN)
VBUS: USB1.1(VBUS)
VCC: C58.2 C85.2 C86.2 C87.2 C88.2 C89.2 C92.2 C93.2 C95.2 C96.2 L3.2 LED1.1(A) R73.2 R75.2 R80.1 R84.2 R94.2 R95.2 R97.2 R98.2 R104.2 U35.16(DVDD) U43.6(VOS) U45.1(VCC) U47.8(VCC) U48.4(V3) U48.16(VCC) U49.2(3V3)
A: CN3.2 D6.2 U47.6(A)
AI0: C41.2 R65.1 U35.6(AIN0)
AI1: C42.2 R66.1 U35.7(AIN1)
AI2: C43.2 R67.1 U35.8(AIN2)
AI3: C44.2 R68.1 U35.9(AIN3)
AI4: C47.2 R69.1 U35.10(AIN4)
AI5: C48.2 R70.1 U35.11(AIN5)
AI6: C49.2 R71.1 U35.12(AIN6)
AI7: C50.2 R72.1 U35.13(AIN7)
AIN0: R65.2 U2.6(VOUT)
AIN1: R66.2 U3.6(VOUT)
AIN2: R67.2 U9.6(VOUT)
AIN3: R68.2 U25.6(VOUT)
AIN4: R69.2 U29.6(VOUT)
AIN5: R70.2 U21.6(VOUT)
AIN6: R71.2 U17.6(VOUT)
AIN7: R72.2 U13.6(VOUT)
ANT: G$1.SIG U45.6(ANT)
B: CN3.1 D6.1 U47.7(B)
BATMON: C71.2 R82.2 R83.1 U49.4(IO4)
BUZZER: U44.3(I3) U49.33(IO40)
CFG: R80.2 SW1.1 U49.9(IO16)
CLR: R107.1 U49.31(IO38) U51.6(#CLR)
D+: D5.2 U48.5(D+) USB1.3(D+)
D-: D4.2 U48.6(D-) USB1.2(D-)
DCFAN: U44.1(I1) U49.35(IO42)
DIO1: U45.20(DIO1) U49.39(IO1)
DIR: U47.2(RE#) U47.3(DE) U49.13(IO19)
DONE: U46.4(DONE) U49.22(IO14)
DRDY: U35.21(DRDY) U49.18(IO10)
DTR: Q1.2(B1) Q1.4(E2) U48.13(DTR#)
ENA: U41.2(EN) U51.5(Q)
IO0: C90.2 Q1.3(C2) R94.1 U49.27(IO0)
LAMP: U44.2(I2) U49.34(IO41)
LED: R93.1 U49.32(IO39)
LORA_BUSY: U45.11(BUSY) U49.8(IO15)
LORA_RST: U45.3(NRST) U49.38(IO2)
LORA_SS: U45.14(NSS) U49.7(IO7)
PDOWN: R75.1 U35.14(SYNCPDWN) U49.11(IO18)
PG24: R84.1 U36.5(PG) U49.26(IO45)
PRE: U51.7(#PRE) U52.4(Y)
RST: C91.2 Q1.6(C1) R95.1 U46.6(RSTn) U49.3(EN)
RSTA: C66.2 R77.1 U33.3(RESET#)
RTS: Q1.1(E1) Q1.5(B2) U48.14(RTS#)
RX2: U47.1(R) U49.14(IO20)
RXD: U48.2(TXD) U49.36(RXD0)
RXEN: U45.10(RXEN) U49.5(IO5)
SCL: R98.1 U33.22(SCL) U49.17(IO9)
SCL0: U27.5(SCL) U33.5(SC0)
SCL1: U31.5(SCL) U33.7(SC1)
SCL2: U23.5(SCL) U33.9(SC2)
SCL3: U19.5(SCL) U33.11(SC3)
SCL4: U15.5(SCL) U33.14(SC4)
SCL5: U11.5(SCL) U33.16(SC5)
SCL6: U6.5(SCL) U33.18(SC6)
SCL7: U8.5(SCL) U33.20(SC7)
SDA: R97.1 U33.23(SDA) U49.12(IO8)
SDA0: U27.4(SDA) U33.4(SD0)
SDA1: U31.4(SDA) U33.6(SD1)
SDA2: U23.4(SDA) U33.8(SD2)
SDA3: U19.4(SDA) U33.10(SD3)
SDA4: U15.4(SDA) U33.13(SD4)
SDA5: U11.4(SDA) U33.15(SD5)
SDA6: U6.4(SDA) U33.17(SD6)
SDA7: U8.4(SDA) U33.19(SD7)
SPI_CS: U35.20(CS) U49.24(IO47)
SPI_MISO: U35.22(DOUT) U45.12(MISO) U49.21(IO13)
SPI_MOSI: U35.23(DIN) U45.13(MOSI) U49.19(IO11)
SPI_SCK: U35.24(SCLK) U45.15(SCK) U49.20(IO12)
TX2: U47.4(D) U49.23(IO21)
TXD: R96.1 U49.37(TXD0)
TXEN: U45.9(TXEN) U49.6(IO6)
VREF: C51.2 C56.1 R74.2 U35.4(VREFP)
WAKE: U46.5(WAKE) U52.2(A)
Net-(C1-1): C1.1 R14.2 U2.3(VIN+)
Net-(C1-2): C1.2 R11.2 U2.2(VIN-)
Net-(C3-1): C3.1 R21.2 U2.5(REF)
Net-(C4-1): C4.1 R12.2 U3.5(REF)
Net-(C5-1): C5.1 R8.2 U3.3(VIN+)
Net-(C5-2): C5.2 R9.2 U3.2(VIN-)
Net-(C9-1): C9.1 R24.2 U9.5(REF)
Net-(C10-1): C10.1 R18.2 U9.3(VIN+)
Net-(C10-2): C10.2 R19.2 U9.2(VIN-)
Net-(C16-1): C16.1 R32.2 U13.5(REF)
Net-(C17-1): C17.1 R29.2 U13.3(VIN+)
Net-(C17-2): C17.2 R30.2 U13.2(VIN-)
Net-(C21-1): C21.1 R40.2 U17.5(REF)
Net-(C22-1): C22.1 R37.2 U17.3(VIN+)
Net-(C22-2): C22.2 R38.2 U17.2(VIN-)
Net-(C26-1): C26.1 R48.2 U21.5(REF)
Net-(C27-1): C27.1 R45.2 U21.3(VIN+)
Net-(C27-2): C27.2 R46.2 U21.2(VIN-)
Net-(C31-1): C31.1 R56.2 U25.5(REF)
Net-(C32-1): C32.1 R53.2 U25.3(VIN+)
Net-(C32-2): C32.2 R54.2 U25.2(VIN-)
Net-(C36-1): C36.1 R64.2 U29.5(REF)
Net-(C37-1): C37.1 R61.2 U29.3(VIN+)
Net-(C37-2): C37.2 R62.2 U29.2(VIN-)
Net-(C45-1): C45.1 U35.19(XTAL1CLKIN) U39.3
Net-(C53-1): C53.1 R76.2 U38.4(VOUT)
Net-(C54-2): C54.2 C55.2 R76.1 U37.1(+IN)
Net-(C57-2): C57.2 U35.18(XTAL2) U39.1
Net-(C59-2): C59.2 C60.2 C61.2 Q3.5(D) Q3.6(D) Q3.7(D) Q3.8(D) U36.9(EN) U36.10(VIN) U36.11(VIN) U36.12(VIN)
Net-(C69-1): C69.1 U36.1(SW) U36.2(SW) U36.3(SW) U40.1
Net-(C69-2): C69.2 U36.4(BOOT)
Net-(C70-1): C70.1 R87.1
Net-(C70-2): C70.2 R85.1 R86.2 U36.7(FB)
Net-(C76-1): C76.1 U41.8(BOOT)
Net-(C76-2): C76.2 L2.2 R88.1 U41.4(SW) U41.5(SW) U41.6(SW) U41.7(SW)
Net-(C77-2): C77.2 U41.1(VCC)
Net-(C78-2): C78.2 C79.2 C80.2 C81.2 D9.1(A) R90.1 U41.14(VOUT) U41.15(VOUT) U41.16(VOUT)
Net-(C82-1): C82.1 R91.2
Net-(C83-1): C83.1 R91.1 U41.18(COMP)
Net-(C84-2): C84.2 U41.10(SS)
Net-(C97-2): C97.2 D3.3(K) R100.2 U42.1(IN)
Net-(CN1-2): CN1.2 U44.16(O1)
Net-(CN2-1): CN2.1 J1.1 J1.3 J1.5
Net-(D1-1): D1.1(K) D2.1(K) F1.2 Q3.1(S) Q3.2(S) Q3.3(S)
Net-(D2-2): D2.2(A) Q3.4(G) R81.2
Net-(F1-1): F1.1 J1.6
Net-(J2-2): J2.2 U44.15(O2)
Net-(J2-3): J2.3 U44.14(O3)
Net-(L3-1): L3.1 U43.7(SW)
Net-(LED1-2): LED1.2(C) R93.2
Net-(R1-1): R1.1 U2.1(RG)
Net-(R1-2): R1.2 U2.8(RG)
Net-(R2-1): R2.1 U3.1(RG)
Net-(R2-2): R2.2 U3.8(RG)
Net-(R3-2): R3.2 R4.2 R9.1 U7.5(B) U7.7(B)
Net-(R5-1): R5.1 R6.2 R14.1
Net-(R7-1): R7.1 R8.1 R10.2
Net-(R11-1): R11.1 R22.2 R23.2 U1.5(B) U1.7(B)
Net-(R12-1): R12.1 U4.3(-IN) U4.4(OUT)
Net-(R13-1): R13.1 U9.1(RG)
Net-(R13-2): R13.2 U9.8(RG)
Net-(R15-2): R15.2 R16.2 R19.1 U12.5(B) U12.7(B)
Net-(R17-1): R17.1 R18.1 R20.2
Net-(R21-1): R21.1 U5.3(-IN) U5.4(OUT)
Net-(R24-1): R24.1 U10.3(-IN) U10.4(OUT)
Net-(R25-1): R25.1 U13.1(RG)
Net-(R25-2): R25.2 U13.8(RG)
Net-(R26-2): R26.2 R27.2 R30.1 U16.5(B) U16.7(B)
Net-(R28-1): R28.1 R29.1 R31.2
Net-(R32-1): R32.1 U14.3(-IN) U14.4(OUT)
Net-(R33-1): R33.1 U17.1(RG)
Net-(R33-2): R33.2 U17.8(RG)
Net-(R34-2): R34.2 R35.2 R38.1 U20.5(B) U20.7(B)
Net-(R36-1): R36.1 R37.1 R39.2
Net-(R40-1): R40.1 U18.3(-IN) U18.4(OUT)
Net-(R41-1): R41.1 U21.1(RG)
Net-(R41-2): R41.2 U21.8(RG)
Net-(R42-2): R42.2 R43.2 R46.1 U24.5(B) U24.7(B)
Net-(R44-1): R44.1 R45.1 R47.2
Net-(R48-1): R48.1 U22.3(-IN) U22.4(OUT)
Net-(R49-1): R49.1 U25.1(RG)
Net-(R49-2): R49.2 U25.8(RG)
Net-(R50-2): R50.2 R51.2 R54.1 U28.5(B) U28.7(B)
Net-(R52-1): R52.1 R53.1 R55.2
Net-(R56-1): R56.1 U26.3(-IN) U26.4(OUT)
Net-(R57-1): R57.1 U29.1(RG)
Net-(R57-2): R57.2 U29.8(RG)
Net-(R58-2): R58.2 R59.2 R62.1 U32.5(B) U32.7(B)
Net-(R60-1): R60.1 R61.1 R63.2
Net-(R64-1): R64.1 U30.3(-IN) U30.4(OUT)
Net-(R73-1): R73.1 U35.15(RESET)
Net-(R74-1): R74.1 U37.3(-IN) U37.4(OUT)
Net-(R78-1): R78.1 R79.2 U34.3(IN+)
Net-(R88-2): R88.2 U41.3(FSW)
Net-(R89-1): R89.1 R90.2 U41.17(FB)
Net-(R92-2): R92.2 U46.3(DELAY/M_RST)
Net-(R96-2): R96.2 U48.3(RXD)
Net-(R99-1): R99.1 U41.19(ILIM)
Net-(R100-1): R100.1 U42.3(EN)
Net-(R104-1): R104.1 U43.8(PG)
Net-(R105-2): R105.2 U51.1(CLK)
Net-(R106-2): R106.2 U51.2(D)
Net-(U4-1): U4.1(+IN) U6.1(VOUT)
Net-(U5-1): U5.1(+IN) U8.1(VOUT)
Net-(U10-1): U10.1(+IN) U11.1(VOUT)
Net-(U14-1): U14.1(+IN) U15.1(VOUT)
Net-(U18-1): U18.1(+IN) U19.1(VOUT)
Net-(U22-1): U22.1(+IN) U23.1(VOUT)
Net-(U26-1): U26.1(+IN) U27.1(VOUT)
Net-(U30-1): U30.1(+IN) U31.1(VOUT)

Not connected (* = marked no-connect by the designer): U1 4(NC)*; U7 4(NC)*; U12 4(NC)*; U16 4(NC)*; U20 4(NC)*; U24 4(NC)*; U28 4(NC)*; U32 4(NC)*; U35 25(D0CLKOUT)* 26(D1)* 27(D2)* 28(D3)*; U36 6(RT)*; U38 1(TEMP)* 5(TRIM)*; U41 11(NC)* 12(NC)* 13(MODE)*; U42 4(NC)*; U44 4(I4) 5(I5) 6(I6) 7(I7) 10(O7) 11(O6) 12(O5) 13(O4); U45 4(NC)* 5(NC)* 8(NC)* 17(NC)* 18(DIO3) 19(DIO2); U48 7(NC.) 8(NC.) 9(CTS#) 10(DSR#) 11(RI#) 12(DCD#) 15(R232); U49 10(IO17) 15(IO3) 16(IO46) 25(IO48) 28(IO35) 29(IO36) 30(IO37); U51 3(#Q)*; U52 1(NC)*; USB1 4(ID)*
